# EAGLE schematic basicbridge5v1A (EAGLE 9.6.2)
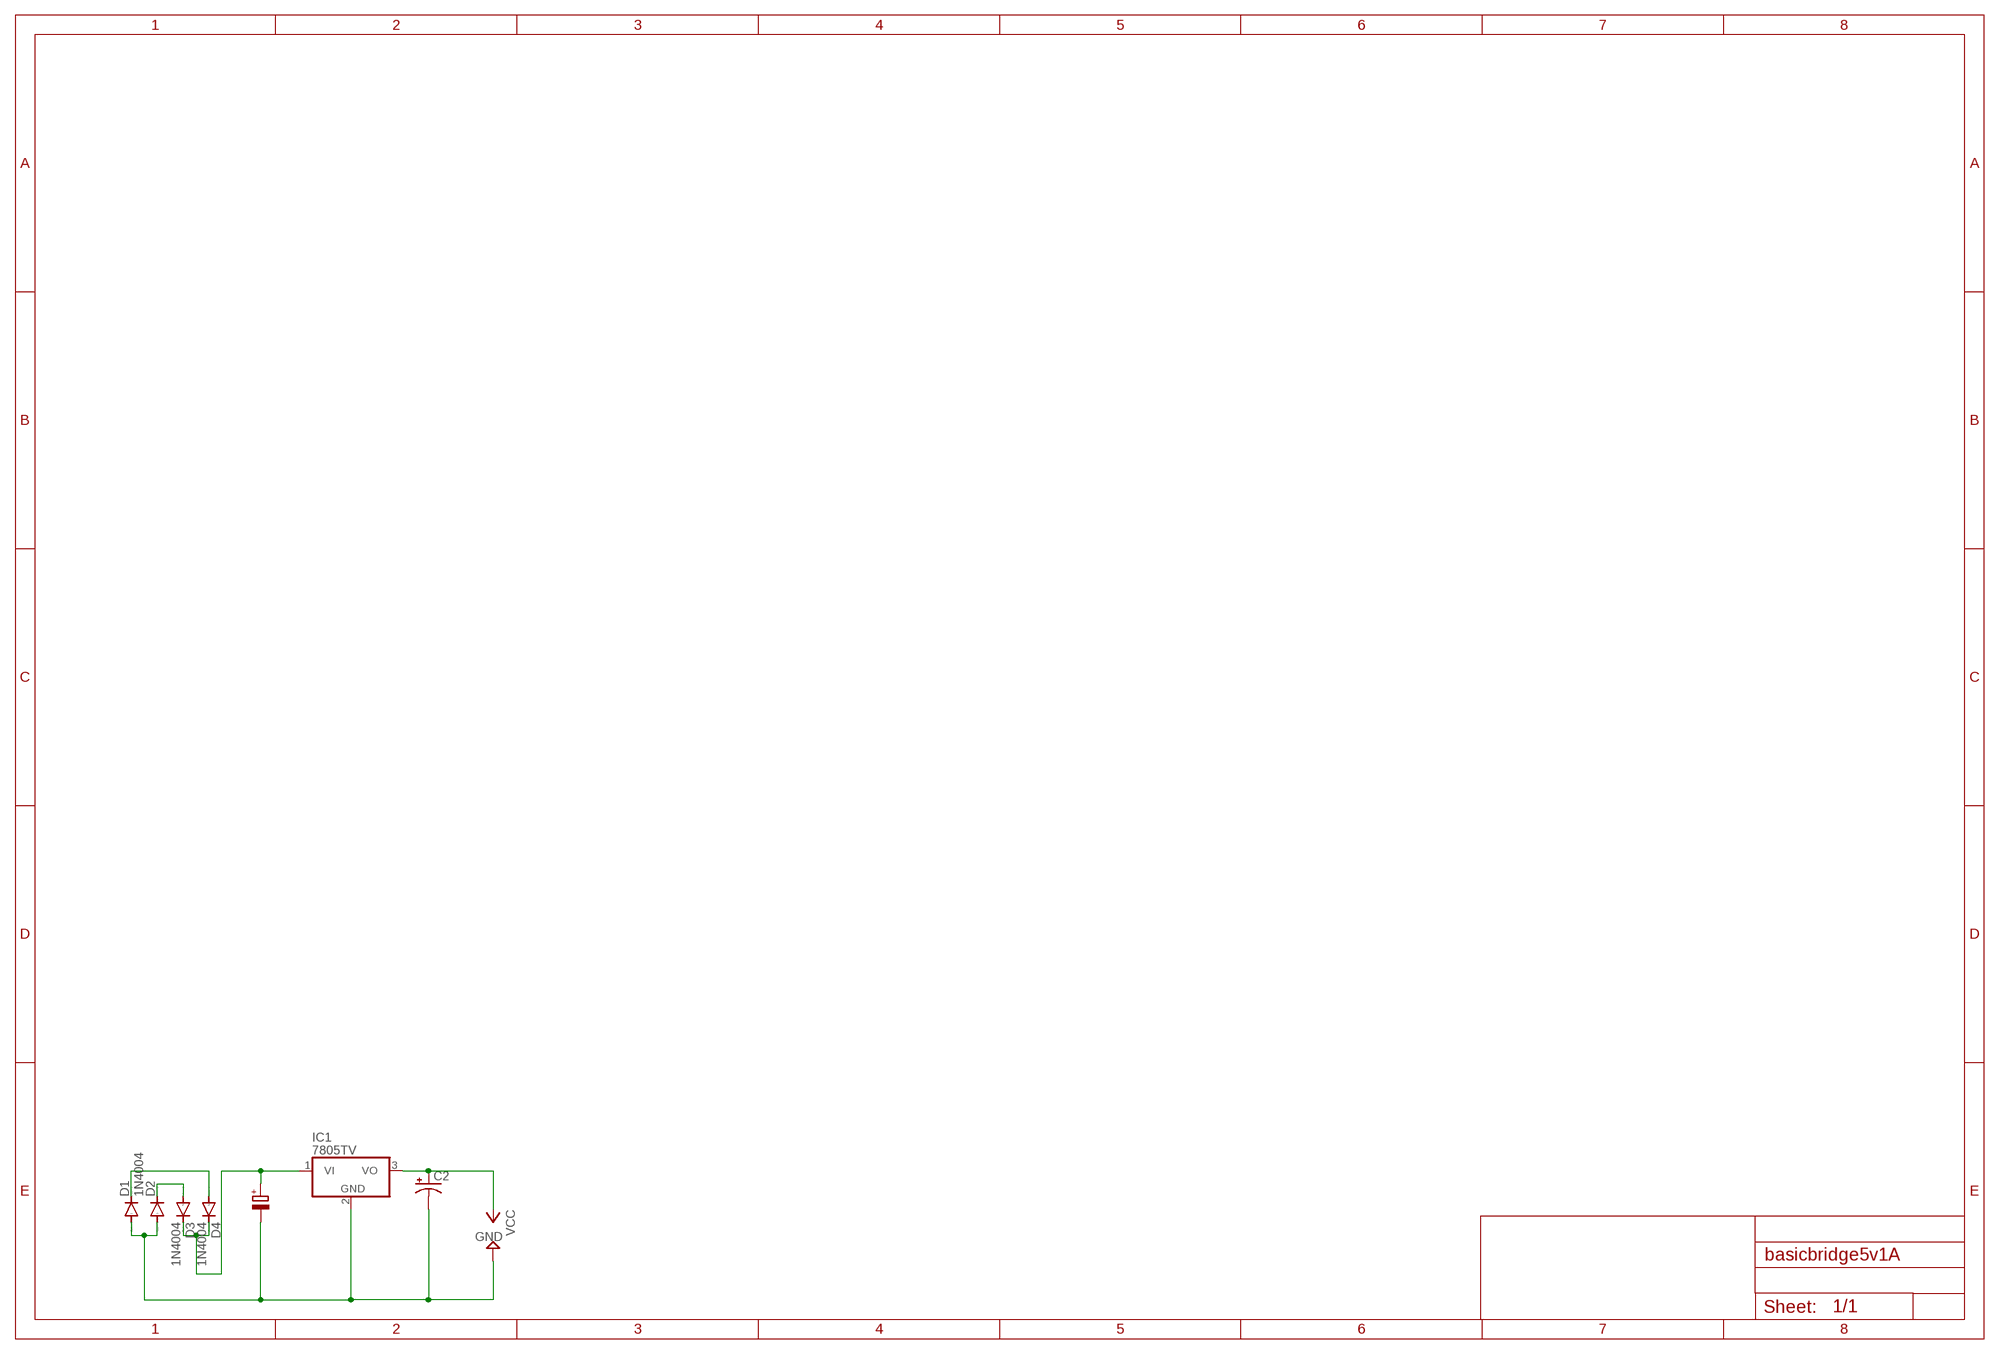
[diagram p0: schematic, sheet 1]

## Parts
C2  CPOL-USE2.5-5V  [E2,5-4R]
D1  1N4004  [DO41-10]
D2  1N4004  [DO41-10]
D3  1N4004  [DO41-10]
D4  1N4004  [DO41-10]
IC1  7805TV  [TO220V]

## Nets
GND: C2.- D1.A D2.A IC1.2(GND)
N$1: D1.C D4.A
N$2: D2.C D3.A
N$7: D3.C D4.C IC1.1(VI)
VCC: C2.+ IC1.3(VO)

## Library data of the parts
C2 = rcl:CPOL-US: POLARIZED CAPACITOR, American symbol; SPICEPREFIX: C
D1-D4 = diode:1N4004: DIODE general purpose rectifier, 1 A
IC1 = linear:78*: Positive VOLTAGE REGULATOR Source: http://cache.national.com/ds/LM/LM78L05.pdf http://www.fairchildsemi.com/ds/LM/LM7805.pdf